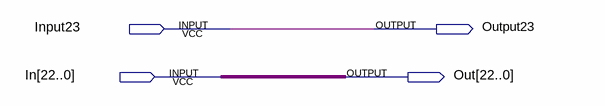
[diagram p0: schematic sheet]
// Quartus schematic ConvertBus24bit.bdf as structural Verilog: 0 symbols, 4 pins
module ConvertBus24bit (
  input  Input23,
  input  [22:0] In,
  output Output23,
  output [22:0] Out
);


  assign Out = In;
  assign Output23 = Input23;
endmodule
